# Altium project base_tiempo.PrjPcb
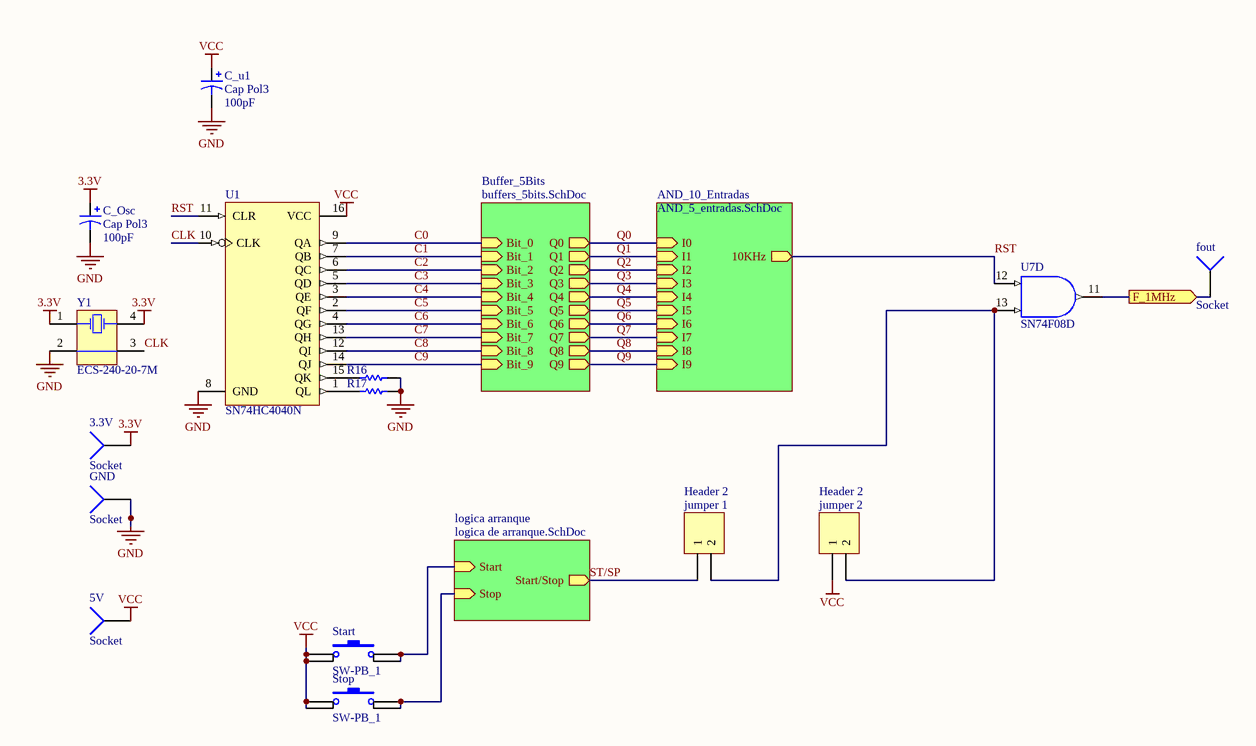
[diagram p0: base_tiempo.SchDoc]
5 sheets, 49 parts. Net scope: hierarchical (ports join the sheet entries above them; power ports are global).
Board files: base_tiempo.PcbDoc, base_tiempo2.PcbDoc
Sheets:
  base_tiempo.SchDoc
    Buffer_5Bits = buffers_5bits.SchDoc
    logica arranque = logica de arranque.SchDoc
    AND_10_Entradas = AND_5_entradas.SchDoc
  selector.SchDoc

## Sheet base_tiempo.SchDoc: Base de tiempo
size A4; Revision: 1

### Parts
3.3V  Socket  [PIN1]
5V  Socket  [PIN1]
C_Osc  Cap Pol3  value 100pF  [C0805]
C_u1  Cap Pol3  value 100pF  [C0805]
fout  Socket  [PIN1]
GND  Socket  [PIN1]
jumper_1  Header 2  [HDR1X2]
jumper_2  Header 2  [HDR1X2]
R16  Res Semi  [2012[0805]]  (value not drawn)
R17  Res Semi  [2012[0805]]  (value not drawn)
Start  SW-PB_1  [SPST-44]
Stop  SW-PB_1  [SPST-44]
U1  SN74HC4040N  [N016]
U7  SN74F08D  [D014_N]  (part D of 4)
Y1  ECS-240-20-7M  [ECX-3M]

### Sub-sheets
AND_10_Entradas = AND_5_entradas.SchDoc: I0 (in), I1 (in), I2 (in), I3 (in), I4 (in), 10KHz (out), I5 (in), I6 (in), I7 (in), I8 (in), I9 (in)
Buffer_5Bits = buffers_5bits.SchDoc: Bit_0 (in), Bit_1 (in), Bit_2 (in), Bit_3 (in), Bit_4 (in), Q0 (out), Q1 (out), Q2 (out), Q3 (out), Q4 (out), Bit_5 (in), Bit_6 (in), Bit_7 (in), Bit_8 (in), Bit_9 (in), Q5 (out), Q6 (out), Q7 (out), Q8 (out), Q9 (out)
logica arranque = logica de arranque.SchDoc: Start (in), Stop (in), Start/Stop (out)

### Ports
F_1MHz (out)

### Nets
3.3V: 3.3V.1 C_Osc.1 Y1.1(OSC1) Y1.4(OSC2)
GND: C_Osc.2 C_u1.2 GND.1 R16.2 R17.2 U1.8(GND) U7.7(GND) Y1.2(COM)
VCC: 5V.1 C_u1.1 jumper_2.1 Start.1 Start.3 Stop.1 Stop.3 U1.16(VCC) U7.14(VCC)
C0: U1.9(QA) ; sheet Buffer_5Bits/Bit_0
C1: U1.7(QB) ; sheet Buffer_5Bits/Bit_1
C2: U1.6(QC) ; sheet Buffer_5Bits/Bit_2
C3: U1.5(QD) ; sheet Buffer_5Bits/Bit_3
C4: U1.3(QE) ; sheet Buffer_5Bits/Bit_4
C5: U1.2(QF) ; sheet Buffer_5Bits/Bit_5
C6: U1.4(QG) ; sheet Buffer_5Bits/Bit_6
C7: U1.13(QH) ; sheet Buffer_5Bits/Bit_7
C8: U1.12(QI) ; sheet Buffer_5Bits/Bit_8
C9: U1.14(QJ) ; sheet Buffer_5Bits/Bit_9
CLK: U1.10(CLK) Y1.3(COM)
Q0: sheet Buffer_5Bits/Q0, sheet AND_10_Entradas/I0
Q1: sheet Buffer_5Bits/Q1, sheet AND_10_Entradas/I1
Q2: sheet Buffer_5Bits/Q2, sheet AND_10_Entradas/I2
Q3: sheet Buffer_5Bits/Q3, sheet AND_10_Entradas/I3
Q4: sheet Buffer_5Bits/Q4, sheet AND_10_Entradas/I4
Q5: sheet Buffer_5Bits/Q5, sheet AND_10_Entradas/I5
Q6: sheet Buffer_5Bits/Q6, sheet AND_10_Entradas/I6
Q7: sheet Buffer_5Bits/Q7, sheet AND_10_Entradas/I7
Q8: sheet Buffer_5Bits/Q8, sheet AND_10_Entradas/I8
Q9: sheet Buffer_5Bits/Q9, sheet AND_10_Entradas/I9
RST: U1.11(CLR) U7.12(A) ; sheet AND_10_Entradas/10KHz  [project net 10KHz]
ST/SP: jumper_1.1 ; sheet logica arranque/Start/Stop
Netfout_1: fout.1 U7.11(Y) ; port F_1MHz
Netjumper_1_2: jumper_1.2 jumper_2.2 U7.13(B)
NetR16_1: R16.1 U1.15(QK)
NetR17_1: R17.1 U1.1(QL)
NetR20_1: Start.2 Start.4 ; sheet logica arranque/Start
NetR21_2: Stop.2 Stop.4 ; sheet logica arranque/Stop

### Library data of the parts
C_Osc C_u1 = Cap Pol3: Polarized Capacitor (Surface Mount); Published: 8-Jun-2000; LatestRevisionDate: 17-Jul-2002; LatestRevisionNote: Re-released for DXP Platform.; PackageReference: C0805; Publisher: Altium Limited
jumper_1 jumper_2 = Header 2: Header, 2-Pin; LatestRevisionDate: 17-Jul-2002; LatestRevisionNote: Re-released for DXP Platform.; Publisher: Altium Limited
R16 R17 = Res Semi: Semiconductor Resistor; Value: 1K; Published: 8-Jun-2000; LatestRevisionDate: 17-Jul-2002; LatestRevisionNote: Re-released for DXP Platform.; PackageReference: AXIAL-0.5; Publisher: Altium Limited
Start Stop = SW-PB_1: Switch; Published: 24-Mar-1999; LatestRevisionDate: 17-Jul-2002; LatestRevisionNote: Re-released for DXP Platform.; PackageReference: SPST-2; Publisher: Altium Limited
U1 = SN74HC4040N: 12-Bit Asynchronous Binary Counter; Published: 8-Jun-2000; LatestRevisionDate: 04-Mar-2005; LatestRevisionNote: Stylized 3D Model Added.; DatasheetVersion: May-1997; PackageVersion: Oct-1995; PackageReference: N016; Publisher: Altium Limited; PackageDescription: DIP; 16 Leads; Row Spacing 7.62 mm; Pitch 2.54 mm; Code_JEDEC: MS-001-BB; ComponentLink1Description: Manufacturer Link; ComponentLink1URL: http://www.ti.com/; ComponentLink2Description: Datasheet; ComponentLink2URL: http://www-s.ti.com/sc/ds/sn74hc4040.pdf
U7 = SN74F08D: Quadruple 2-Input Positive-AND Gate; Published: 8-Jun-2000; LatestRevisionDate: 13-Apr-2006; LatestRevisionNote: IPC-7351 Footprint Added.; DatasheetVersion: Oct-1993; PackageVersion: Jan-1998; PackageReference: D014; Publisher: Altium Limited; PackageDescription: 14-Pin Small Outline Integrated Circuit 1.27 mm Pitch; Code_IPC: SOIC127P600-14; ComponentLink1Description: Manufacturer Link; ComponentLink1URL: http://www.ti.com/; ComponentLink2Description: Datasheet; ComponentLink2URL: http://www-s.ti.com/sc/ds/SN74F08.pdf
Y1 = ECS-240-20-7M: Crystal Oscillator; Published: 17-Jul-2002; DatasheetDocument: 18-Apr-2000; PackageReference: ECX-3M; Publisher: Altium Limited; ComponentLink1Description: Manufacturer Link; ComponentLink1URL: http://www.ecsxtal.com/
3.3V 5V fout GND = Socket: LatestRevisionDate: 17-Jul-2002; LatestRevisionNote: Re-released for DXP Platform.; Publisher: Altium Limited

## Sheet buffers_5bits.SchDoc
size A4
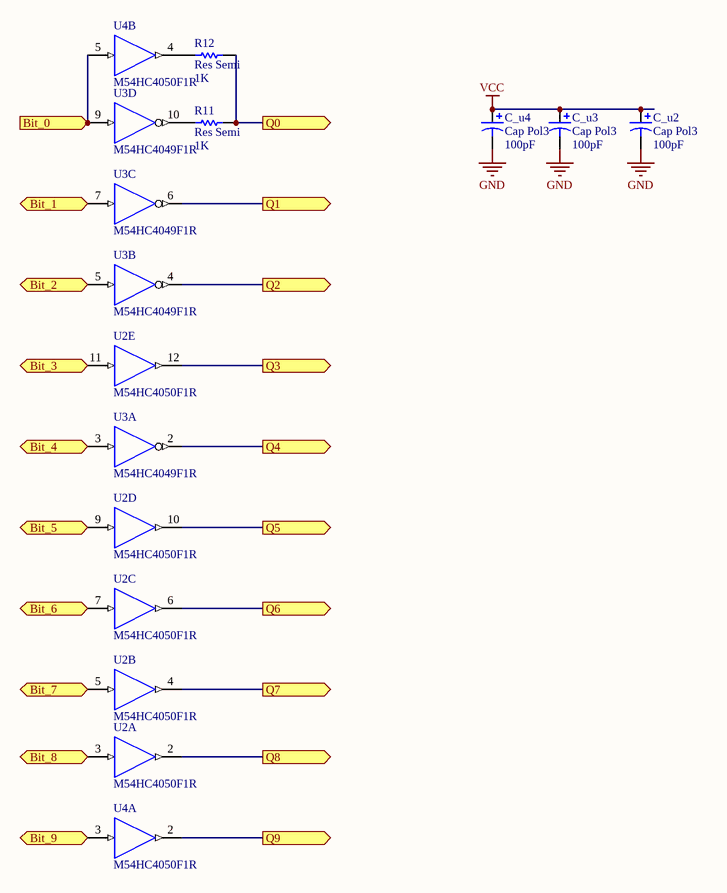
[diagram p1: buffers_5bits.SchDoc]

### Parts
C_u2  Cap Pol3  value 100pF  [C0805]
C_u3  Cap Pol3  value 100pF  [C0805]
C_u4  Cap Pol3  value 100pF  [C0805]
R11  Res Semi  value 1K  [2012[0805]]
R12  Res Semi  value 1K  [2012[0805]]
U2  M54HC4050F1R  [DIP16]  (parts A,B,C,D,E of 6)
U3  M54HC4049F1R  [DIP16]  (parts A,B,C,D of 6)
U4  M54HC4050F1R  [DIP16]  (parts A,B of 6)

### Ports
Bit_0 (in), Bit_1 (in), Bit_2 (in), Bit_3 (in), Bit_4 (in), Bit_5 (out), Bit_6 (out), Bit_7 (out), Bit_8 (out), Bit_9 (out), Q0 (out), Q1 (out), Q2 (out), Q3 (out), Q4 (out), Q5 (out), Q6 (out), Q7 (out), Q8 (out), Q9 (out)

### Nets
GND: C_u2.2 C_u3.2 C_u4.2 U2.8(GND) U3.8(GND) U4.8(GND)
VCC: C_u2.1 C_u3.1 C_u4.1 U2.1(VCC) U3.1(VCC) U4.1(VCC)
C0: U3.9(A) U4.5(A) ; port Bit_0
C1: U3.7(A) ; port Bit_1
C2: U3.5(A) ; port Bit_2
C3: U2.11(A) ; port Bit_3
C4: U3.3(A) ; port Bit_4
C5: U2.9(A) ; port Bit_5
C6: U2.7(A) ; port Bit_6
C7: U2.5(A) ; port Bit_7
C8: U2.3(A) ; port Bit_8
C9: U4.3(A) ; port Bit_9
Q0: R11.1 R12.1 ; port Q0
Q1: U3.6(Y) ; port Q1
Q2: U3.4(Y) ; port Q2
Q3: U2.12(Y) ; port Q3
Q4: U3.2(Y) ; port Q4
Q5: U2.10(Y) ; port Q5
Q6: U2.6(Y) ; port Q6
Q7: U2.4(Y) ; port Q7
Q8: U2.2(Y) ; port Q8
Q9: U4.2(Y) ; port Q9
NetR11_2: R11.2 U3.10(Y)
NetR12_2: R12.2 U4.4(Y)

### Library data of the parts
C_u2-C_u4 = Cap Pol3: Polarized Capacitor (Surface Mount); Published: 8-Jun-2000; LatestRevisionDate: 17-Jul-2002; LatestRevisionNote: Re-released for DXP Platform.; PackageReference: C0805; Publisher: Altium Limited
R11 R12 = Res Semi: Semiconductor Resistor; Published: 8-Jun-2000; LatestRevisionDate: 17-Jul-2002; LatestRevisionNote: Re-released for DXP Platform.; PackageReference: AXIAL-0.5; Publisher: Altium Limited
U2 U4 = M54HC4050F1R: Hex Buffer/Converter Non-Inverting; Note: Pins 13 and 16 are not connected and not drawn.; Published: 8-Jun-2000; LatestRevisionDate: 06-Jun-2005; LatestRevisionNote: Stylized 3D Model Added.; DatasheetVersion: Mar-1993; PackageVersion: Apr-1996; PackageReference: DIP16; Publisher: Altium Limited; PackageDescription: DIP; 16 Leads; Row Spacing 7.62 mm; Pitch 2.54 mm; ComponentLink1Description: Manufacturer Link; ComponentLink1URL: http://www.st.com/
U3 = M54HC4049F1R: Hex Buffer/Converter Invertering; Note: Pins 13 and 16 are not connected and not drawn.; Published: 8-Jun-2000; LatestRevisionDate: 06-Jun-2005; LatestRevisionNote: Stylized 3D Model Added.; DatasheetVersion: Mar-1993; PackageVersion: Apr-1996; PackageReference: DIP16; Publisher: Altium Limited; PackageDescription: DIP; 16 Leads; Row Spacing 7.62 mm; Pitch 2.54 mm; ComponentLink1Description: Manufacturer Link; ComponentLink1URL: http://www.st.com/

## Sheet logica de arranque.SchDoc
size A4
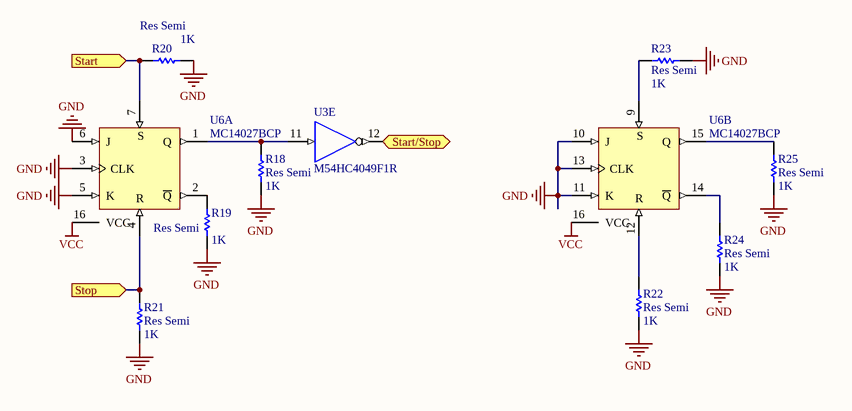
[diagram p2: logica de arranque.SchDoc]

### Parts
R18  Res Semi  value 1K  [2012[0805]]
R19  Res Semi  value 1K  [2012[0805]]
R20  Res Semi  value 1K  [2012[0805]]
R21  Res Semi  value 1K  [2012[0805]]
R22  Res Semi  value 1K  [2012[0805]]
R23  Res Semi  value 1K  [2012[0805]]
R24  Res Semi  value 1K  [2012[0805]]
R25  Res Semi  value 1K  [2012[0805]]
U3  M54HC4049F1R  [DIP16]  (part E of 6)
U6  MC14027BCP  [648-08]  (parts A,B of 2)

### Ports
Start (in), Start/Stop (out), Stop (in)

### Nets
GND: R18.2 R19.1 R20.2 R21.1 R22.1 R23.2 R24.1 R25.1 U3.8(GND) U6.3(CLK) U6.5(K) U6.6(J) U6.8(GND) U6.10(J) U6.11(K) U6.13(CLK)
VCC: U3.1(VCC) U6.16(VCC)
ST/SP: U3.12(Y) ; port Start/Stop
NetR18_1: R18.1 U3.11(A) U6.1(Q)
NetR19_2: R19.2 U6.2(~{Q})
NetR20_1: R20.1 U6.7(S) ; port Start
NetR21_2: R21.2 U6.4(R) ; port Stop
NetR22_2: R22.2 U6.12(R)
NetR23_1: R23.1 U6.9(S)
NetR24_2: R24.2 U6.14(~{Q})
NetR25_2: R25.2 U6.15(Q)

### Library data of the parts
R18-R25 = Res Semi: Semiconductor Resistor; Published: 8-Jun-2000; LatestRevisionDate: 17-Jul-2002; LatestRevisionNote: Re-released for DXP Platform.; PackageReference: AXIAL-0.5; Publisher: Altium Limited
U3 = M54HC4049F1R: as U3 on sheet buffers_5bits; Published: 8-Jun-2000; LatestRevisionDate: 06-Jun-2005; LatestRevisionNote: Stylized 3D Model Added.; DatasheetVersion: Mar-1993; PackageVersion: Apr-1996; PackageReference: DIP16; Publisher: Altium Limited; PackageDescription: DIP; 16 Leads; Row Spacing 7.62 mm; Pitch 2.54 mm; ComponentLink1Description: Manufacturer Link; ComponentLink1URL: http://www.st.com/
U6 = MC14027BCP: Dual J-K Flip-Flop; Published: 15-Apr-2002; DatasheetVersion: 1995; PackageVersion: Apr-2000; PackageReference: 648-08; Publisher: Altium Limited; PackageDescription: DIP; 16 Leads; Row Spacing 7.62 mm; Pitch 2.54 mm; Code_JEDEC: MS-001-BB; ComponentLink1Description: Manufacturer Link; ComponentLink1URL: http://www.onsemi.com/; ComponentLink2Description: Datasheet; ComponentLink2URL: http://www.onsemi.com/pub/Collateral/MC14027B-D.PDF

## Sheet AND_5_entradas.SchDoc
size A4; PageSetup: Record=PageOptions|CenterHorizontal=True|CenterVertical=True|PrintScale=0.97|XCorrection=1.00|YCorrection=1.00|PrintKind=2|BorderSize=5000000|LeftOffset=0|BottomOffset=0|Orientation=2|PaperLength=1000|PaperWidth=1000|Scale=100|PaperSource=7|PrintQuality=-4|MediaType=1|DitherType=10|PaperKind=A4|PrintScaleMode=1
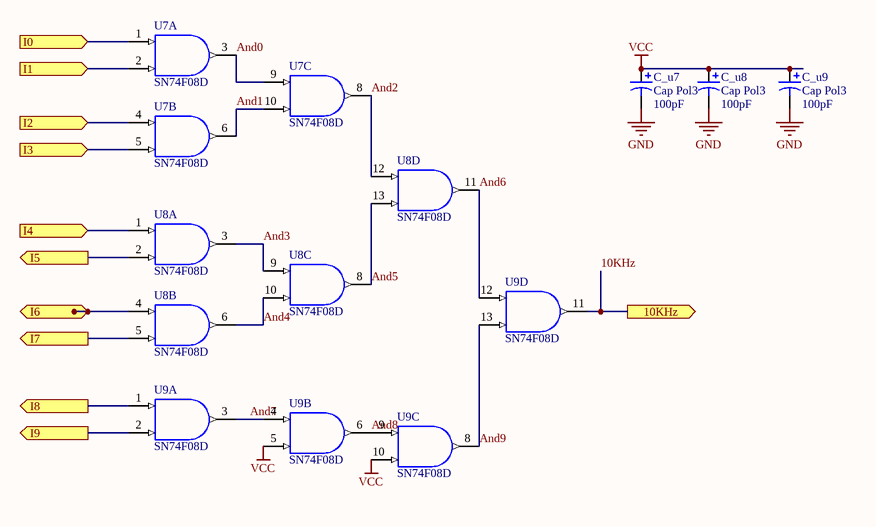
[diagram p3: AND_5_entradas.SchDoc]

### Parts
C_u7  Cap Pol3  value 100pF  [C0805]
C_u8  Cap Pol3  value 100pF  [C0805]
C_u9  Cap Pol3  value 100pF  [C0805]
U7  SN74F08D  [D014_N]  (parts A,B,C of 4)
U8  SN74F08D  [D014_N]  (parts A,B,C,D of 4)
U9  SN74F08D  [D014_N]  (parts A,B,C,D of 4)

### Ports
10KHz (out), I0 (in), I1 (in), I2 (in), I3 (in), I4 (in), I5 (out), I6 (out), I7 (out), I8 (out), I9 (out)

### Nets
GND: C_u7.2 C_u8.2 C_u9.2 U7.7(GND) U8.7(GND) U9.7(GND)
VCC: C_u7.1 C_u8.1 C_u9.1 U7.14(VCC) U8.14(VCC) U9.5(B) U9.10(B) U9.14(VCC)
10KHz: U9.11(Y) ; port 10KHz
And0: U7.3(Y) U7.9(A)
And1: U7.6(Y) U7.10(B)
And2: U7.8(Y) U8.12(A)
And3: U8.3(Y) U8.9(A)
And4: U8.6(Y) U8.10(B)
And5: U8.8(Y) U8.13(B)
And6: U8.11(Y) U9.12(A)
And7: U9.3(Y) U9.4(A)
And8: U9.6(Y) U9.9(A)
And9: U9.8(Y) U9.13(B)
Q0: U7.1(A) ; port I0
Q1: U7.2(B) ; port I1
Q2: U7.4(A) ; port I2
Q3: U7.5(B) ; port I3
Q4: U8.1(A) ; port I4
Q5: U8.2(B) ; port I5
Q6: U8.4(A) ; port I6
Q7: U8.5(B) ; port I7
Q8: U9.1(A) ; port I8
Q9: U9.2(B) ; port I9

### Library data of the parts
C_u7-C_u9 = Cap Pol3: Polarized Capacitor (Surface Mount); Published: 8-Jun-2000; LatestRevisionDate: 17-Jul-2002; LatestRevisionNote: Re-released for DXP Platform.; PackageReference: C0805; Publisher: Altium Limited
U7-U9 = SN74F08D: Quadruple 2-Input Positive-AND Gate; Published: 8-Jun-2000; LatestRevisionDate: 13-Apr-2006; LatestRevisionNote: IPC-7351 Footprint Added.; DatasheetVersion: Oct-1993; PackageVersion: Jan-1998; PackageReference: D014; Publisher: Altium Limited; PackageDescription: 14-Pin Small Outline Integrated Circuit 1.27 mm Pitch; Code_IPC: SOIC127P600-14; ComponentLink1Description: Manufacturer Link; ComponentLink1URL: http://www.ti.com/; ComponentLink2Description: Datasheet; ComponentLink2URL: http://www-s.ti.com/sc/ds/SN74F08.pdf

## Sheet selector.SchDoc
size A4
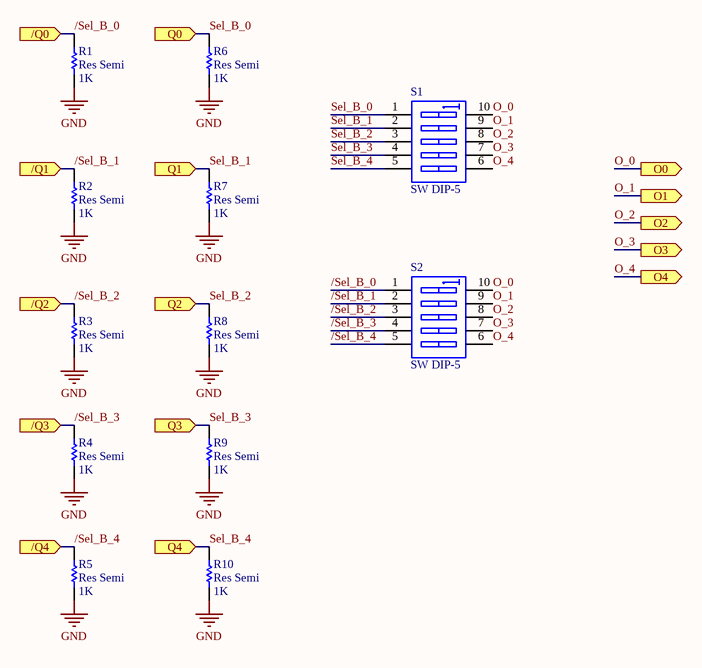
[diagram p4: selector.SchDoc]

### Parts
R1  Res Semi  value 1K  [2012[0805]]
R2  Res Semi  value 1K  [2012[0805]]
R3  Res Semi  value 1K  [2012[0805]]
R4  Res Semi  value 1K  [2012[0805]]
R5  Res Semi  value 1K  [2012[0805]]
R6  Res Semi  value 1K  [2012[0805]]
R7  Res Semi  value 1K  [2012[0805]]
R8  Res Semi  value 1K  [2012[0805]]
R9  Res Semi  value 1K  [2012[0805]]
R10  Res Semi  value 1K  [2012[0805]]
S1  SW DIP-5  [N10A]
S2  SW DIP-5  [N10A]

### Ports
/Q0 (in), /Q1 (in), /Q2 (in), /Q3 (in), /Q4 (in), O0 (out), O1 (out), O2 (out), O3 (out), O4 (out), Q0 (in), Q1 (in), Q2 (in), Q3 (in), Q4 (in)

### Nets
GND: R1.1 R2.1 R3.1 R4.1 R5.1 R6.1 R7.1 R8.1 R9.1 R10.1
/Sel_B_0: R1.2 S2.1(A1) ; port /Q0
/Sel_B_1: R2.2 S2.2(A2) ; port /Q1
/Sel_B_2: R3.2 S2.3(A3) ; port /Q2
/Sel_B_3: R4.2 S2.4(A4) ; port /Q3
/Sel_B_4: R5.2 S2.5(A5) ; port /Q4
O_0: S1.10(B1) S2.10(B1) ; port O0
O_1: S1.9(B2) S2.9(B2) ; port O1
O_2: S1.8(B3) S2.8(B3) ; port O2
O_3: S1.7(B4) S2.7(B4) ; port O3
O_4: S1.6(B5) S2.6(B5) ; port O4
Sel_B_0: R6.2 S1.1(A1) ; port Q0
Sel_B_1: R7.2 S1.2(A2) ; port Q1
Sel_B_2: R8.2 S1.3(A3) ; port Q2
Sel_B_3: R9.2 S1.4(A4) ; port Q3
Sel_B_4: R10.2 S1.5(A5) ; port Q4

### Library data of the parts
R1-R10 = Res Semi: Semiconductor Resistor; Published: 8-Jun-2000; LatestRevisionDate: 17-Jul-2002; LatestRevisionNote: Re-released for DXP Platform.; PackageReference: AXIAL-0.5; Publisher: Altium Limited
S1 S2 = SW DIP-5: DIP Switch, 5 Position, SPST; Published: 24-Mar-1999; LatestRevisionDate: 17-Jul-2002; LatestRevisionNote: Re-released for DXP Platform.; PackageReference: N10A; Publisher: Altium Limited

## Nets that join several sheets
GND: base_tiempo (8 pins), buffers_5bits (6 pins), logica de arranque (16 pins), AND_5_entradas (6 pins), selector (10 pins)
VCC: base_tiempo (9 pins), buffers_5bits (6 pins), logica de arranque (U3.1 U6.16), AND_5_entradas (8 pins)
10KHz: base_tiempo (U1.11 U7.12), AND_5_entradas (U9.11)
C0: base_tiempo (U1.9), buffers_5bits (U3.9 U4.5)
C1: base_tiempo (U1.7), buffers_5bits (U3.7)
C2: base_tiempo (U1.6), buffers_5bits (U3.5)
C3: base_tiempo (U1.5), buffers_5bits (U2.11)
C4: base_tiempo (U1.3), buffers_5bits (U3.3)
C5: base_tiempo (U1.2), buffers_5bits (U2.9)
C6: base_tiempo (U1.4), buffers_5bits (U2.7)
C7: base_tiempo (U1.13), buffers_5bits (U2.5)
C8: base_tiempo (U1.12), buffers_5bits (U2.3)
C9: base_tiempo (U1.14), buffers_5bits (U4.3)
NetR20_1: base_tiempo (Start.2 Start.4), logica de arranque (R20.1 U6.7)
NetR21_2: base_tiempo (Stop.2 Stop.4), logica de arranque (R21.2 U6.4)
Q0: buffers_5bits (R11.1 R12.1), AND_5_entradas (U7.1)
Q1: buffers_5bits (U3.6), AND_5_entradas (U7.2)
Q2: buffers_5bits (U3.4), AND_5_entradas (U7.4)
Q3: buffers_5bits (U2.12), AND_5_entradas (U7.5)
Q4: buffers_5bits (U3.2), AND_5_entradas (U8.1)
Q5: buffers_5bits (U2.10), AND_5_entradas (U8.2)
Q6: buffers_5bits (U2.6), AND_5_entradas (U8.4)
Q7: buffers_5bits (U2.4), AND_5_entradas (U8.5)
Q8: buffers_5bits (U2.2), AND_5_entradas (U9.1)
Q9: buffers_5bits (U4.2), AND_5_entradas (U9.2)
ST/SP: base_tiempo (jumper_1.1), logica de arranque (U3.12)